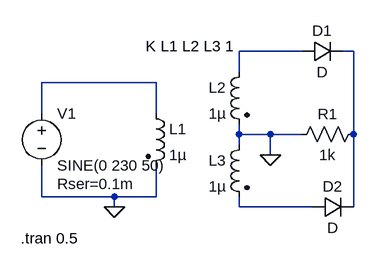
[diagram p0: schematic Full_Wave_Rectifier_LTSPICE.asc]
Full_Wave_Rectifier_LTSPICE.asc, the LTspice schematic file:
Version 4
SHEET 1 880 680
WIRE 384 32 288 32
WIRE 464 32 448 32
WIRE 288 64 288 32
WIRE 160 80 -16 80
WIRE -16 128 -16 80
WIRE 160 128 160 80
WIRE 288 160 288 144
WIRE 336 160 288 160
WIRE 384 160 336 160
WIRE 464 160 464 32
WIRE 288 176 288 160
WIRE 336 192 336 160
WIRE -16 256 -16 208
WIRE 96 256 -16 256
WIRE 160 256 160 208
WIRE 160 256 96 256
WIRE 96 272 96 256
WIRE 288 272 288 256
WIRE 400 272 288 272
WIRE 464 272 464 160
FLAG 336 192 0
FLAG 96 272 0
SYMBOL voltage -16 112 R0
WINDOW 123 0 0 Left 0
WINDOW 39 24 124 Left 2
SYMATTR SpiceLine Rser=0.1m
SYMATTR InstName V1
SYMATTR Value SINE(0 230 50)
SYMBOL ind2 144 112 R0
SYMATTR InstName L1
SYMATTR Value 1µ
SYMATTR Type ind
SYMBOL ind2 304 48 M0
SYMATTR InstName L2
SYMATTR Value 1µ
SYMATTR Type ind
SYMBOL ind2 304 160 M0
SYMATTR InstName L3
SYMATTR Value 1µ
SYMATTR Type ind
SYMBOL diode 384 48 R270
WINDOW 0 32 32 VTop 2
WINDOW 3 0 32 VBottom 2
SYMATTR InstName D1
SYMBOL diode 400 288 R270
WINDOW 0 32 32 VTop 2
WINDOW 3 0 32 VBottom 2
SYMATTR InstName D2
SYMBOL res 480 144 R90
WINDOW 0 0 56 VBottom 2
WINDOW 3 32 56 VTop 2
SYMATTR InstName R1
SYMATTR Value 1k
TEXT 144 24 Left 2 !K L1 L2 L3 1
TEXT -48 320 Left 2 !.tran 0.5

The netlist it stands for:
* Full_Wave_Rectifier_LTSPICE.asc
V1 N003 0 SINE(0 230 50) Rser=0.1m
L1 N003 0 1µ
L2 N001 0 1µ
L3 0 N004 1µ
D1 N001 N002 D
D2 N004 N002 D
R1 N002 0 1k
.model D D
.lib standard.dio
K L1 L2 L3 1
.tran 0.5
.backanno
.end